# Altium schematic sheet C-03 eMMC_NAND_TF_QSPI.SchDoc
size 513 x 386 mm
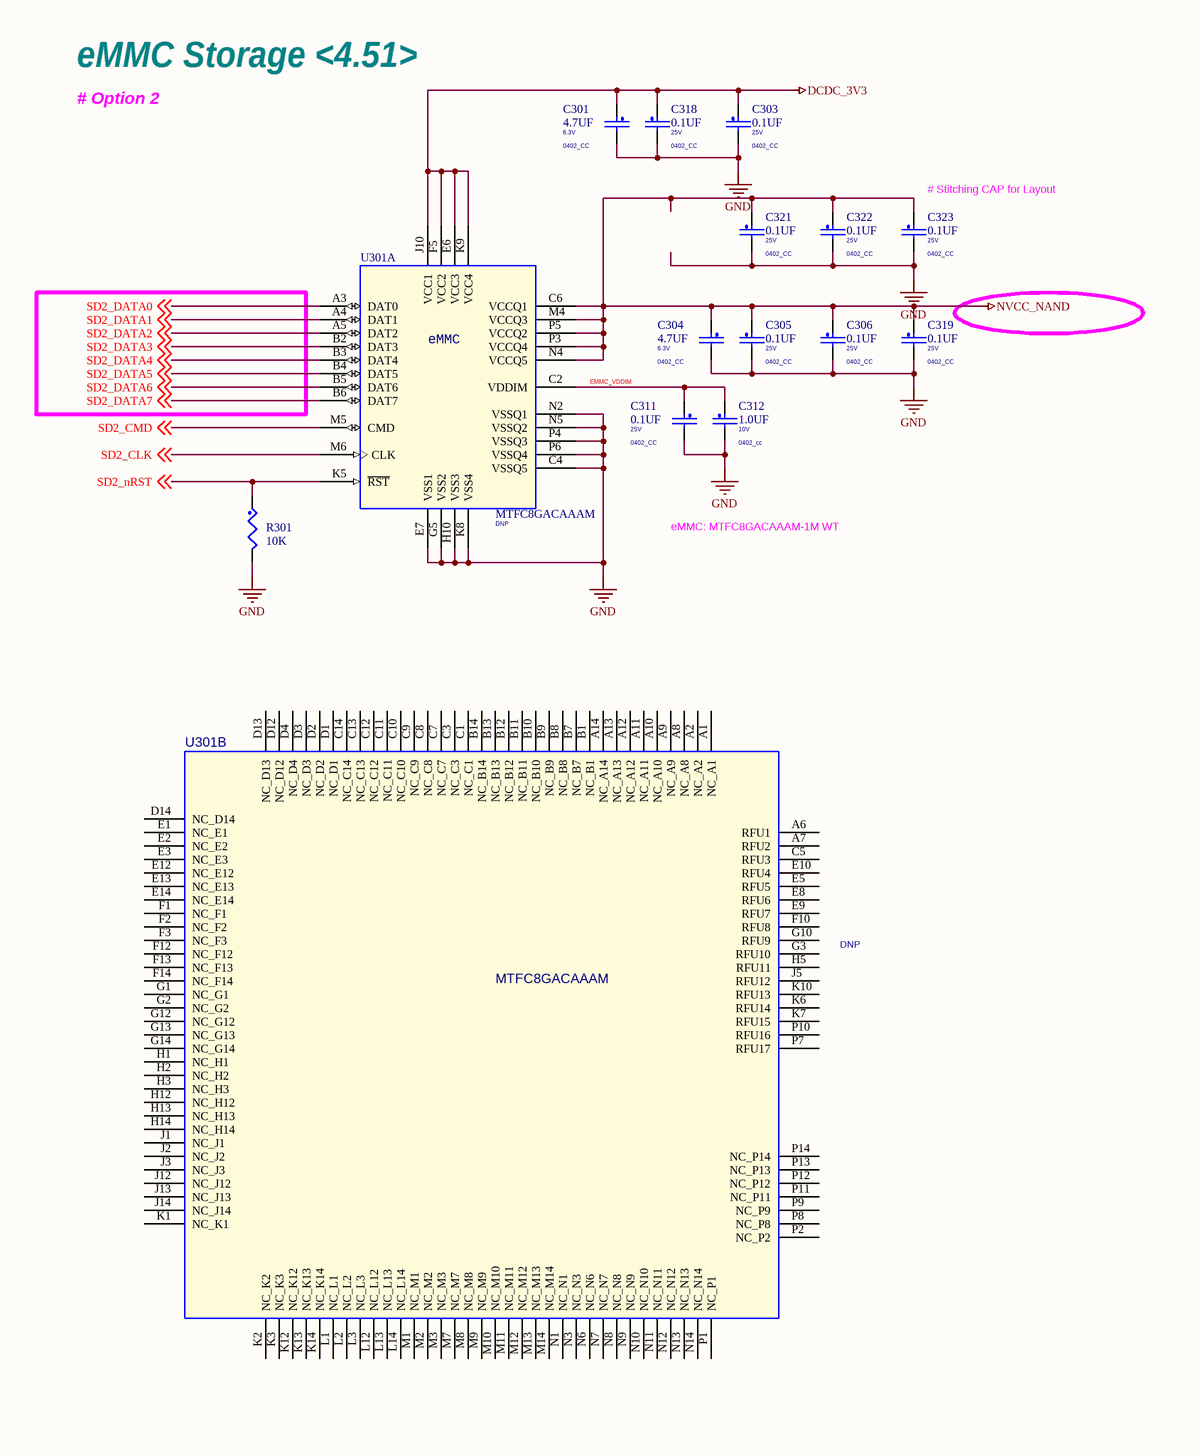
[diagram p0: C-03 eMMC_NAND_TF_QSPI.SchDoc, left]
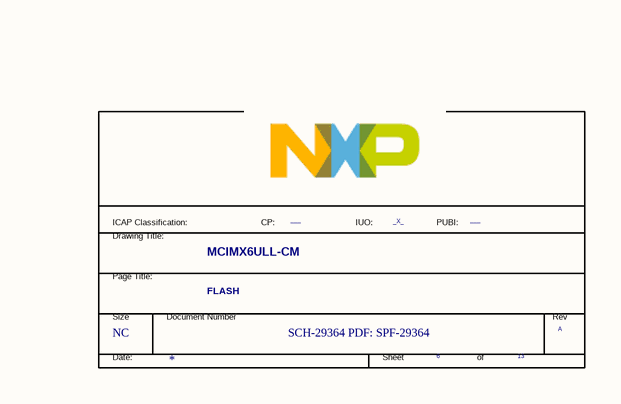
[diagram p1: C-03 eMMC_NAND_TF_QSPI.SchDoc, right]

## Parts
*  FIUO: _X_  PUBI: ___  Doc: SCH-29364 PDF: SPF-29364  RevCode: A  Title: MCIMX6ULL-CM  Page Size: NC  Page Number: 6  Page Count: 13  PageTitle: FLASH  (hidden comment: TitleBlock_FS)  (graphical)
C301  4.7UF  PCB Footprint: 0402_CC  voltage rating: 6.3V  [C0402_H0.5mm]
C303  0.1UF  VOLTAGE: 25V  PCB Footprint: 0402_CC  [C0402_H0.5mm]
C304  4.7UF  voltage rating: 6.3V  PCB Footprint: 0402_CC  [C0402_H0.5mm]
C305  0.1UF  VOLTAGE: 25V  PCB Footprint: 0402_CC  [C0402_H0.5mm]
C306  0.1UF  VOLTAGE: 25V  PCB Footprint: 0402_CC  [C0402_H0.5mm]
C311  0.1UF  VOLTAGE: 25V  PCB Footprint: 0402_CC  [C0402_H0.5mm]
C312  1.0UF  VOLTAGE: 10V  PCB Footprint: 0402_cc  [C0402_H0.5mm]
C318  0.1UF  VOLTAGE: 25V  PCB Footprint: 0402_CC  [C0402_H0.5mm]
C319  0.1UF  VOLTAGE: 25V  PCB Footprint: 0402_CC  [C0402_H0.5mm]
C321  0.1UF  VOLTAGE: 25V  PCB Footprint: 0402_CC  [C0402_H0.5mm]
C322  0.1UF  VOLTAGE: 25V  PCB Footprint: 0402_CC  [C0402_H0.5mm]
C323  0.1UF  VOLTAGE: 25V  PCB Footprint: 0402_CC  [C0402_H0.5mm]
R301  10K  [R0402_H0.35mm]
U301  MTFC8GACAAAM  ASSY_OPT: DNP  [BGA153_11.5x13mm]  (parts A,B of 2)

## Nets
DCDC_3V3: C301.1 C303.1 C318.1 U301.E6(VCC3) U301.F5(VCC2) U301.J10(VCC1) U301.K9(VCC4)
GND: C301.2 C303.2 C304.2 C305.2 C306.2 C311.2 C312.2 C318.2 C319.2 C321.2 C322.2 C323.2 R301.2 U301.C4(VSSQ5) U301.E7(VSS1) U301.G5(VSS2) U301.H10(VSS3) U301.K8(VSS4) U301.N2(VSSQ1) U301.N5(VSSQ2) U301.P4(VSSQ3) U301.P6(VSSQ4)
NVCC_NAND: C304.1 C305.1 C306.1 C319.1 C321.1 C322.1 C323.1 U301.C6(VCCQ1) U301.M4(VCCQ3) U301.N4(VCCQ5) U301.P3(VCCQ4) U301.P5(VCCQ2)
EMMC_VDDIM: C311.1 C312.1 U301.C2(VDDIM)
SD2_CLK: U301.M6(CLK) ; off-sheet SD2_CLK
SD2_CMD: U301.M5(CMD) ; off-sheet SD2_CMD
SD2_DATA0: U301.A3(DAT0) ; off-sheet SD2_DATA0
SD2_DATA1: U301.A4(DAT1) ; off-sheet SD2_DATA1
SD2_DATA2: U301.A5(DAT2) ; off-sheet SD2_DATA2
SD2_DATA3: U301.B2(DAT3) ; off-sheet SD2_DATA3
SD2_DATA4: U301.B3(DAT4) ; off-sheet SD2_DATA4
SD2_DATA5: U301.B4(DAT5) ; off-sheet SD2_DATA5
SD2_DATA6: U301.B5(DAT6) ; off-sheet SD2_DATA6
SD2_DATA7: U301.B6(DAT7) ; off-sheet SD2_DATA7
SD2_nRST: R301.1 U301.K5(~{RST}) ; off-sheet SD2_nRST

Not connected (* = marked no-connect by the designer): U301 A1(NC_A1) A2(NC_A2) A6(RFU1) A7(RFU2) A8(NC_A8) A9(NC_A9) A10(NC_A10) A11(NC_A11) A12(NC_A12) A13(NC_A13) A14(NC_A14) B1(NC_B1) B7(NC_B7) B8(NC_B8) B9(NC_B9) B10(NC_B10) B11(NC_B11) B12(NC_B12) B13(NC_B13) B14(NC_B14) C1(NC_C1) C3(NC_C3) C5(RFU3) C7(NC_C7) C8(NC_C8) C9(NC_C9) C10(NC_C10) C11(NC_C11) C12(NC_C12) C13(NC_C13) C14(NC_C14) D1(NC_D1) D2(NC_D2) D3(NC_D3) D4(NC_D4) D12(NC_D12) D13(NC_D13) D14(NC_D14) E1(NC_E1) E2(NC_E2) E3(NC_E3) E5(RFU5) E8(RFU6) E9(RFU7) E10(RFU4) E12(NC_E12) E13(NC_E13) E14(NC_E14) F1(NC_F1) F2(NC_F2) F3(NC_F3) F10(RFU8) F12(NC_F12) F13(NC_F13) F14(NC_F14) G1(NC_G1) G2(NC_G2) G3(RFU10) G10(RFU9) G12(NC_G12) G13(NC_G13) G14(NC_G14) H1(NC_H1) H2(NC_H2) H3(NC_H3) H5(RFU11) H12(NC_H12) H13(NC_H13) H14(NC_H14) J1(NC_J1) J2(NC_J2) J3(NC_J3) J5(RFU12) J12(NC_J12) J13(NC_J13) J14(NC_J14) K1(NC_K1) K2(NC_K2) K3(NC_K3) K6(RFU14) K7(RFU15) K10(RFU13) K12(NC_K12) K13(NC_K13) K14(NC_K14) L1(NC_L1) L2(NC_L2) L3(NC_L3) L12(NC_L12) L13(NC_L13) L14(NC_L14) M1(NC_M1) M2(NC_M2) M3(NC_M3) M7(NC_M7) M8(NC_M8) M9(NC_M9) M10(NC_M10) M11(NC_M11) M12(NC_M12) M13(NC_M13) M14(NC_M14) N1(NC_N1) N3(NC_N3) N6(NC_N6) N7(NC_N7) N8(NC_N8) N9(NC_N9) N10(NC_N10) N11(NC_N11) N12(NC_N12) N13(NC_N13) N14(NC_N14) P1(NC_P1) P2(NC_P2) P7(RFU17) P8(NC_P8) P9(NC_P9) P10(RFU16) P11(NC_P11) P12(NC_P12) P13(NC_P13) P14(NC_P14)

## Notes on the sheet
- eMMC Storage <4.51>
- # Option 2
- (near C323) # Stitching CAP for Layout
- eMMC: MTFC8GACAAAM-1M WT
- (in symbol MTFC4GMVEA_WFBGA_153P, part A) eMMC
- (in symbol TitleBlock_FS) ICAP Classification:; CP:; IUO:; PUBI:; Drawing Title:; Page Title:; Size; Document Number; Rev; Date:; Sheet; of

## Library data of the parts
* = TitleBlock_FS: OrgAddr2: Austin, TX 78735-8598; OrgAddr1: 6501 William Cannon Drive West; OrgName: Freescale Semiconductor; FCP: ___; Page Create Date: March  8, 1995; Page Modify Date: *
C301 = CAP_NP: CAP CER 4.7UF 6.3V 20% X5R 0402; CLASS: DISCRETE; AGILE_PN: 150-78463; MFG_NAME01: VENKEL COMPANY; MFG_PN01: C0402X5R6R3-475MNP; CAD_APPROVED: Yes; FPLIST: CC0402_25,CC0402_HD,0402_CC; VOLTAGE: 6.3V; Tolerance: 20%; ROHS: Yes; HEIGHT: 0.65MM
C303 C319 C321 = CAP_NP: CAP CER 0.1UF 25V 10% X5R 0402; CLASS: DISCRETE; AGILE_PN: 150-78633; MFG_NAME01: YAGEO AMERICA; MFG_PN01: CC0402KRX5R8BB104; CAD_APPROVED: Yes; FPLIST: CC0402_25,CC0402_HD,0402_CC; Tolerance: 10%; ROHS: Yes; HEIGHT: 0.55MM
C304 = CAP_NP: CAP CER 4.7UF 6.3V 20% X5R 0402; CLASS: DISCRETE; FPLIST: CC0402_25,CC0402_HD,0402_CC; CAD_APPROVED: Yes; MFG_PN01: C0402X5R6R3-475MNP; MFG_NAME01: VENKEL COMPANY; AGILE_PN: 150-78463; HEIGHT: 0.65MM; ROHS: Yes; Tolerance: 20%; VOLTAGE: 6.3V
C305 C306 C311 C318 C322 C323 = CAP_NP: CAP CER 0.1UF 25V 10% X5R 0402; CLASS: DISCRETE; FPLIST: CC0402_25,CC0402_HD,0402_CC; CAD_APPROVED: Yes; MFG_PN01: CC0402KRX5R8BB104; MFG_NAME01: YAGEO AMERICA; AGILE_PN: 150-78633; HEIGHT: 0.55MM; ROHS: Yes; Tolerance: 10%
C312 = CAP_NP: CAP CER 1.0UF 10V 10% X5R 0402; CLASS: DISCRETE; FPLIST: CC0402_25,CC0402_HD,0402_CC; CAD_APPROVED: Yes; MFG_PN01: CC0402KRX5R6BB105; MFG_NAME01: YAGEO AMERICA; AGILE_PN: 150-75772; HEIGHT: 0.6MM; ROHS: Yes
R301 = RES: RES MF 10K 1/16W 5% 0402; CLASS: DISCRETE; PCB Footprint: 0402_CC; FPLIST: RC0402_25,RC0402_HD,0402_CC; CAD_APPROVED: Yes; MFG_PN01: CRCW040210K0JNED; MFG_NAME01: VISHAY INTERTECHNOLOGY; AGILE_PN: 470-75557; ROHS: Yes; Tolerance: 5%; TOL: 5%; HEIGHT: 0.4 MM
U301 = MTFC4GMVEA_WFBGA_153P: IC MEM NAND FLASH 8GB MMC 4.51 CTLR 2.7-3.6V FBGA153; PCB Footprint: FBGA153_0P5_11P5X13; AGILE_PN: 342-00603; MFG_NAME01: MICRON; MFG_PN01: MTFC8GACAAAM-1M WT; CAD_APPROVED: Yes; CLASS: IC; ROHS: Yes; HEIGHT: 1.165 MM